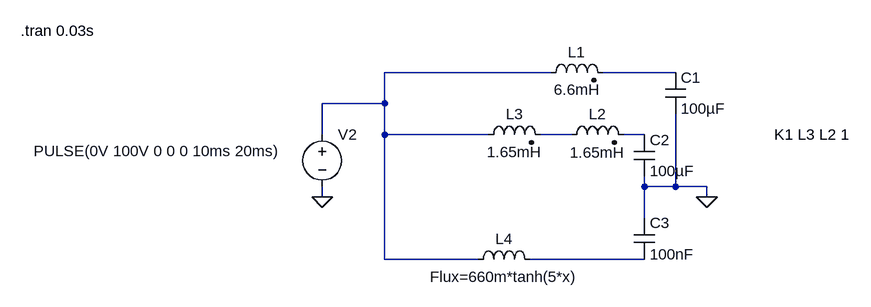
[diagram p0: schematic inductors on same core.asc]
inductors on same core.asc, the LTspice schematic file:
Version 4
SHEET 1 880 680
WIRE 176 48 -80 48
WIRE 368 48 256 48
WIRE -80 96 -80 48
WIRE -80 96 -176 96
WIRE -176 144 -176 96
WIRE -80 144 -80 96
WIRE 80 144 -80 144
WIRE 208 144 160 144
WIRE 320 144 288 144
WIRE 320 224 320 208
WIRE 368 224 368 112
WIRE 368 224 320 224
WIRE 416 224 368 224
WIRE -176 240 -176 224
WIRE 416 240 416 224
WIRE 320 272 320 224
WIRE -80 336 -80 144
WIRE 64 336 -80 336
WIRE 320 336 144 336
FLAG -176 240 0
FLAG 416 240 0
SYMBOL ind2 160 64 R270
WINDOW 0 32 56 VTop 2
WINDOW 3 5 56 VBottom 2
SYMATTR InstName L1
SYMATTR Value 6.6mH
SYMATTR Type ind
SYMBOL ind2 192 160 R270
WINDOW 0 32 56 VTop 2
WINDOW 3 4 56 VBottom 2
SYMATTR InstName L2
SYMATTR Value 1.65mH
SYMATTR Type ind
SYMBOL ind2 64 160 R270
WINDOW 0 32 56 VTop 2
WINDOW 3 5 56 VBottom 2
SYMATTR InstName L3
SYMATTR Value 1.65mH
SYMATTR Type ind
SYMBOL voltage -176 128 R0
WINDOW 3 -444 41 Left 2
WINDOW 123 0 0 Left 0
WINDOW 39 0 0 Left 0
SYMATTR Value PULSE(0V 100V 0 0 0 10ms 20ms)
SYMATTR InstName V2
SYMBOL cap 352 48 R0
SYMATTR InstName C1
SYMATTR Value 100µF
SYMBOL cap 304 144 R0
SYMATTR InstName C2
SYMATTR Value 100µF
SYMBOL cap 304 272 R0
SYMATTR InstName C3
SYMATTR Value 100nF
SYMBOL ind 48 352 R270
WINDOW 0 32 56 VTop 2
WINDOW 3 5 56 VBottom 2
SYMATTR InstName L4
SYMATTR Value Flux=660m*tanh(5*x)
TEXT -640 -16 Left 2 !.tran 0.03s
TEXT 520 144 Left 2 !K1 L3 L2 1

The netlist it stands for:
* inductors on same core.asc
L1 N001 N002 6.6mH
L2 N003 N004 1.65mH
L3 N001 N003 1.65mH
V2 N001 0 PULSE(0V 100V 0 0 0 10ms 20ms)
C1 N002 0 100µF
C2 N004 0 100µF
C3 0 N005 100nF
L4 N001 N005 Flux=660m*tanh(5*x)
.tran 0.03s
K1 L3 L2 1
.backanno
.end